# Altium schematic sheet Top.SchDoc: STEVAL-ESLWB0CB
size A; Date: Not used; ApprovedBy: Not used; CheckedBy: Not used; Author: Not used; CompanyName: STMicroelectronics; DrawnBy: Not used; Engineer: Not used; Organization: Not used; Address1: Not used; Address2: Not used; Address3: Not used; Address4: Not used; DocumentNumber: Not used; Revision: 1.0.0; SheetNumber: 1; SheetTotal: 6; Board_Name: STM32WB09 ESL DEMO; VersionControl_ProjFolderRevNumber: Test; VersionControl_RevNumber: Test; Board_Document_Date: 11/29/2023; CurrentTime: Not used; CurrentDate: Not used; Time: Not used; DocumentFullPathAndName: Not used; DocumentName: Not used; ModifiedDate: Not used; ImagePath: Not used; ProjectName: Not used; Application_BuildNumber: Not used
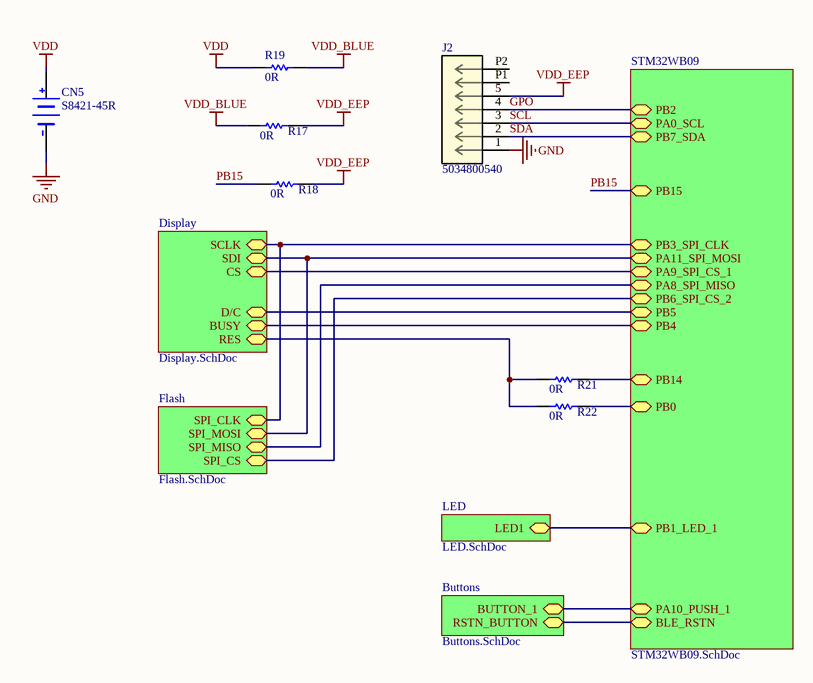
[diagram p0: Top.SchDoc]

## Parts
CN5  value S8421-45R  [BAT_HARWIN_S8421-45R_CR2032_SMD_2P]  (hidden comment: BATTERY HOLDER)
J2  5034800540  [CON_5034800540_MOL]
R17  value 0R  [R0402]  (hidden comment: Resistor)
R18  value 0R  [R0402]  (hidden comment: Resistor)
R19  value 0R  [R0603]  (hidden comment: Resistor)
R21  value 0R  [R0402]  (hidden comment: Resistor)
R22  value 0R  [R0402]  (hidden comment: Resistor)

## Sub-sheets
Buttons = Buttons.SchDoc: BUTTON_1 (bidir), RSTN_BUTTON (bidir)
Display = Display.SchDoc: RES (bidir), BUSY (bidir), D/C (bidir), SCLK (bidir), SDI (bidir), CS (bidir)
Flash = Flash.SchDoc: SPI_MOSI (bidir), SPI_MISO (bidir), SPI_CS (bidir), SPI_CLK (bidir)
LED = LED.SchDoc: LED1 (bidir)
STM32WB09 = STM32WB09.SchDoc: PA0_SCL (bidir), PA8_SPI_MISO (bidir), PA9_SPI_CS_1 (bidir), PA10_PUSH_1 (bidir), PA11_SPI_MOSI (bidir), PB14 (bidir), PB7_SDA (bidir), PB6_SPI_CS_2 (bidir), PB5 (bidir), PB4 (bidir), PB3_SPI_CLK (bidir), PB2 (bidir), PB1_LED_1 (bidir), BLE_RSTN (bidir), PB0 (bidir), PB15 (bidir)

## Nets
GND: CN5.2(-) J2.1
VDD: CN5.1(+) R19.1
VDD_BLUE: R17.1 R19.2
VDD_EEP: J2.5 R17.2 R18.2
GPO: J2.4 ; sheet STM32WB09/PB2
PB15: R18.1 ; sheet STM32WB09/PB15
SCL: J2.3 ; sheet STM32WB09/PA0_SCL
SDA: J2.2 ; sheet STM32WB09/PB7_SDA
NetR21_1: R21.1 R22.1 ; sheet Display/RES
NetR21_2: R21.2 ; sheet STM32WB09/PB14
NetR22_2: R22.2 ; sheet STM32WB09/PB0
(unnamed): sheet STM32WB09/PA8_SPI_MISO, sheet Flash/SPI_MISO
(unnamed): sheet STM32WB09/PA9_SPI_CS_1, sheet Display/CS
(unnamed): sheet STM32WB09/PA10_PUSH_1, sheet Buttons/BUTTON_1
(unnamed): sheet STM32WB09/PA11_SPI_MOSI, sheet Flash/SPI_MOSI, sheet Display/SDI
(unnamed): sheet STM32WB09/PB6_SPI_CS_2, sheet Flash/SPI_CS
(unnamed): sheet STM32WB09/PB5, sheet Display/D/C
(unnamed): sheet STM32WB09/PB4, sheet Display/BUSY
(unnamed): sheet STM32WB09/PB3_SPI_CLK, sheet Flash/SPI_CLK, sheet Display/SCLK
(unnamed): sheet STM32WB09/PB1_LED_1, sheet LED/LED1
(unnamed): sheet STM32WB09/BLE_RSTN, sheet Buttons/RSTN_BUTTON

Not connected (* = marked no-connect by the designer): J2 P1 P2

## Notes on the sheet
- Title:
- Size:
- Date:
- A
- Revision:
- Sheet
- of
- File:

## Library data of the parts
CN5 = MCD-02936: CR2032 compact battery holder; Part_Type: Connector; Part_Preference: Recommended; Manufacturer: HARWIN; Component_Country_Of_Origin: Taiwan; ShowFields: YES; ID: 5052; Internal_Part_Number: MCD-02936; Status: Checked; Manufacturer_Part_Number: S8421-45R; ComponentLink1URL: http://tunmcdsvn.tun.st.com/Component_Documentation_Library/Trunk/Connector/HARWIN_S8421-45R; Order_Code_Digikey: 952-1737-2-ND; Order_Code_Farnell: 3517387; Order_Code_RS: N/A; Manufacturer Part Number: S8421-45R
J2 = 5034800540_5_circuits: FFC/FPC Connector, 0.50mm Pitch, Dual Contact, 1.00mm Height, 5 Circuits, Gold over Nickel Plating; Mfr_Name: Molex Connector Corporation; Manufacturer: Molex; Copyright: Copyright (C) 2023 Ultra Librarian. All rights reserved.; Manufacturer_Part_Number: 5034800540; RefDes: RefDes; Type: DEV; Manufacturer Part Number: 5034800540; Supplier 1: Farnell; Supplier Part Number 1: 3911206; RoHS: No; Category: FFC / FPC; Stock 1: 26696; Pricing 1: 1=0.844, 112=0.49, 337=0.484, 900=0.477, 2250=0.384 (EUR); Supplier 2: Digikey; Supplier Part Number 2: 900-5034800540CT-ND; Stock 2: 26076; Pricing 2: 1=0.85, 10=0.63, 25=0.5652, 50=0.5228, 100=0.4851, 250=0.442, 500=0.41382, 1000=0.38894 (USD)
R17 R18 R21 R22 = MCD-00052: Resistor, 0R, 0402, +/-5%, 1/16W; Part_Preference: Recommended; Manufacturer: YAGEO; Manufacturer_Part_Number: RC0402JR-070RL; Order_Code_RS: 9232516RL; Component_Country_Of_Origin: China; ShowFields: YES; ID: 2540; Internal_Part_Number: MCD-00052; Status: Released; Part_Type: Resistor; Package: 0402; ComponentLink1URL: http://tunmcdsvn.tun.st.com/Component_Documentation_Library/Trunk/Resistor/YAGEO_RC_L_Series; Order_Code_Digikey: 311-0.0JRCT-ND; Order_Code_Farnell: 9232516RL; Manufacturer Part Number: RC0402JR-070RL
R19 = MCD-00181: Resistor, 0R, 0603, +/- 0.5mR, 1/4W; Part_Preference: Recommended; Manufacturer: ROHM SEMICONDUCTOR; Manufacturer_Part_Number: PMR03EZPJ000; Component_Country_Of_Origin: Philippines, Thailand; ShowFields: YES; ID: 2691; Internal_Part_Number: MCD-00181; Status: Released; Part_Type: Resistor; Package: 0603; ComponentLink1URL: http://tunmcdsvn.tun.st.com/Component_Documentation_Library/Trunk/Resistor/ROHM_PMR_Series; Order_Code_Digikey: PMR03EZPJ000-ND; Order_Code_Farnell: N/A; Order_Code_RS: N/A; Manufacturer Part Number: PMR03EZPJ000